# Altium schematic sheet UART Bus.SchDoc
size A
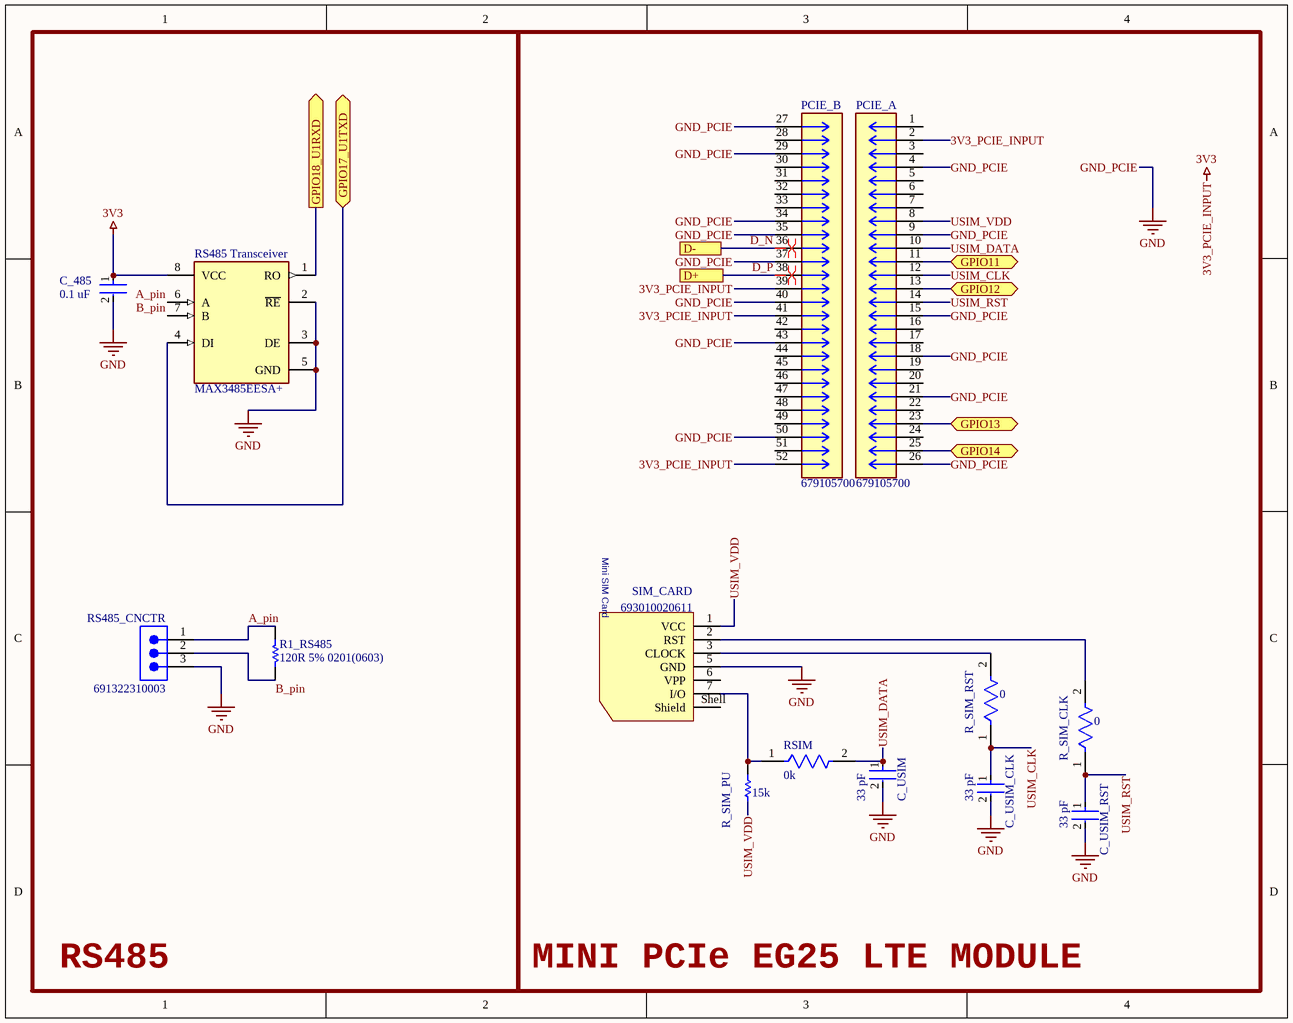
[diagram p0: UART Bus.SchDoc]

## Parts
C_485  0.1 uF  [FP-GRM155-0_05-MFG]
C_USIM  33 pF  [FP-GCM155-0_05-IPC_A]
C_USIM_CLK  33 pF  [FP-GCM155-0_05-IPC_A]
C_USIM_RST  33 pF  [FP-GCM155-0_05-IPC_A]
PCIE_  679105700  [CONN_679105700_MOL]  (parts A,B of 2)
R1_RS485  120R 5% 0201(0603)  [RESC0201(0603)_M]
R_SIM_CLK  0  [FP-CRG0402-IPC_C]
R_SIM_PU  15k  [RESC3116X65X40NL10T20]
R_SIM_RST  0  [FP-CRG0402-IPC_C]
RS485_CNCTR  691322310003  [691322310003]
RS485_Transceiver  MAX3485EESA+  [FP-S8-5-MFG]
RSIM  0k  [FP-CRG0402-IPC_C]
SIM_CARD  693010020611  [693010020611]

## Blocks framed on the sheet
RS485: C_485 R1_RS485 RS485_CNCTR RS485_Transceiver
MINI PCIe EG25 LTE MODULE: C_USIM C_USIM_CLK C_USIM_RST PCIE_ R_SIM_CLK R_SIM_PU R_SIM_RST RSIM SIM_CARD

## Ports
D+, D-, GPIO11 (bidir), GPIO12 (bidir), GPIO13 (bidir), GPIO14 (bidir), GPIO17_U1TXD (bidir), GPIO18_U1RXD (out)

## Nets
3V3_PCIE_INPUT: C_485.1 PCIE_.2 PCIE_.39 PCIE_.41 PCIE_.52 RS485_Transceiver.8(VCC)  [also labelled 3V3]
GND_PCIE: C_485.2 C_USIM.2 C_USIM_CLK.2 C_USIM_RST.2 PCIE_.4 PCIE_.9 PCIE_.15 PCIE_.18 PCIE_.21 PCIE_.26 PCIE_.27 PCIE_.29 PCIE_.34 PCIE_.35 PCIE_.37 PCIE_.40 PCIE_.43 PCIE_.50 RS485_CNCTR.3 RS485_Transceiver.2(~{RE}) RS485_Transceiver.3(DE) RS485_Transceiver.5(GND) SIM_CARD.5(GND)  [also labelled GND]
A_pin: R1_RS485.1 RS485_CNCTR.1 RS485_Transceiver.6(A)
B_pin: R1_RS485.2 RS485_CNCTR.2 RS485_Transceiver.7(B)
D_N: PCIE_.36 ; port D-
D_P: PCIE_.38 ; port D+
GPIO11: PCIE_.11 ; port GPIO11
GPIO12: PCIE_.13 ; port GPIO12
GPIO13: PCIE_.23 ; port GPIO13
GPIO14: PCIE_.25 ; port GPIO14
GPIO17_U1TXD: RS485_Transceiver.4(DI) ; port GPIO17_U1TXD
GPIO18_U1RXD: RS485_Transceiver.1(RO) ; port GPIO18_U1RXD
USIM_CLK: C_USIM_CLK.1 PCIE_.12 R_SIM_RST.1
USIM_DATA: C_USIM.1 PCIE_.10 RSIM.2
USIM_RST: C_USIM_RST.1 PCIE_.14 R_SIM_CLK.1
USIM_VDD: PCIE_.8 R_SIM_PU.2 SIM_CARD.1(VCC)
NetR_SIM_CLK_2: R_SIM_CLK.2 SIM_CARD.2(RST)
NetR_SIM_PU_1: R_SIM_PU.1 RSIM.1 SIM_CARD.7(I/O)
NetR_SIM_RST_2: R_SIM_RST.2 SIM_CARD.3(CLOCK)

Not connected (* = marked no-connect by the designer): PCIE_ 1 3 5 6 7 16 17 19 20 22 24 28 30 31 32 33 42 44 45 46 47 48 49 51; SIM_CARD 6(VPP) Shell(Shield)

## Layout directives
differential pair: D_N, D_P

## Notes on the sheet
- (in symbol CMP-1502-00155-3) Mini SIM Card

## Library data of the parts
C_485 = CMP-06035-062118-1: Chip Multilayer Ceramic Capacitors for General Purpose, 0402, 0.10uF, X7R, 15%, 20%, 50V; RoHS Compliant: Yes
C_USIM C_USIM_CLK C_USIM_RST = CMP-2008-03705-2: Ceramic Capacitor for Automotive 33pF ±5% 50VDC C0G 0402 Paper T/R; Voltage Rating: 50V; Tolerance: 5%; Packaging: Tape and Reel; Case/Package: 0402; Package Quantity: 10000; Dielectric: C0G; Voltage Rating (DC): 50V; Case Code (Imperial): 0402; Width: 0.02inch; Length: 1mm; Capacitance: 33pF; Mount: Surface Mount; Case Code (Metric): 1005; Weight: 0.000212oz; Thickness: 0.022inch; Lead Free: Lead Free; Height: 0.5mm; Max Operating Temperature: 125°C; Termination: SMD/SMT; Min Operating Temperature: -55°C; Depth: 0.5mm; Ratings: AEC-Q200
PCIE_ = CMP-018-000000-1: Pin Count: 52; Package: None; Availability: Unavailable; MP: 679105700; Value: *; Source: 679105700.SchLib; Price: None; Design Item ID: 679105700; Component Type: Standard
R1_RS485 = CMP-1010-00052-1: 120R 0.05W 5% 0201 (0603 Metric)  SMD; Case-EIA: 0201; Case-Metric: 0603; Value: 120.00 Ohm; Power: 0.05 W; Tolerance: 5 %; Technology: SMT
R_SIM_CLK R_SIM_RST RSIM = CMP-03211-011400-1: RES SMD 0 OHM JUMPER 1/16W 0402; Number of Resistors: 1; Tolerance: 0%; Voltage Rating: 50V; Insulation Resistance: 1GR; Power Rating: 63mW; Temperature Coefficient: 200ppm/°C; Resistance: 0mR; Weight: 2.3E-05oz; Number of Terminations: 2; Technology: THICK FILM; Resistor Type: Thick Film; Mount: Surface Mount; Termination: Solder; Number of Pins: 2; RoHS Compliant: Yes; Packaging: Tape and Reel; Depth: 0.5mm; Case Code (Metric): 1005; Min Operating Temperature: -55°C; Series: CRG; Height: 0.35mm; Voltage Rating (DC): 50V; Case Code (Imperial): 0402; Max Operating Temperature: 125°C; ELV: Compliant; Case/Package: 0402; Length: 1mm; Radiation Hardening: No; Width: 0.5mm; Package Quantity: 10000
R_SIM_PU = CMP-2003-03512-1: Manufacturer: Yageo; Part Number: RC1206FR-1015KL
RS485_CNCTR = CMP-1502-01887-3: 322; 3.81mm Pitch Straight Pluggable Term Block; PCB Header; Through Hole; 3 Way; Voltage: 300V; Current: 10A; Gender: Male; Number of Contacts: 3; Number of Levels: 1; Lead Pitch: 3.81mm; Termination: Solder; Packaging: Box; Length: 10.5mm; Contact Plating: Tin; RoHS: Compliant; Number of Rows: 1; Contact Material: Tin; Height: 7.2mm; Color: Green; Number of Pins: 3; Max Operating Temperature: 105°C; Current Rating: 10A; Voltage Rating: 300V; Min Operating Temperature: -40°C; Pitch: 3.81mm; Mount: Through Hole; Number of Positions Per Level: 3; Width: 12.82mm
RS485_Transceiver = CMP-05679-000038-1: IC TXRX RS485/422 10MBPS 8SOIC; Manufacturer: Maxim Integrated; Number Of Receivers: 1; Simplex Duplex: Half Duplex; Data Rate: 15Mbits/s; Interface: RS-485,RS-422; Max Supply Voltage: 3.6V; Nominal Supply Current: 0.95-1.1mA; Min Supply Voltage: 3V; Standoff Height: 0.1mm; Mouser Description: RS-422/RS-485 Interface IC 3.3V 12Mbps Transceiver; Lead Free: Yes; Footprint Url: https://pdfserv.maximintegrated.com/land_patterns/90-0096.PDF; Device Class L1: Integrated Circuits (ICs); Device Class L3: RS-232 / RS-422 / RS-485 Interface ICs; RoHS: TRUE; Height: 1.75mm; ComponentLink2URL: https://datasheets.maximintegrated.com/en/ds/MAX3483E-MAX3491E.pdf; Temperature Range High: +85°C; Temperature: -40°C to +85°C; Manufacturer Part Number: MAX3485EESA+; Number Of Transmitters: 1; Device Class L2: Interface ICs; Octopart: https://octopart.com/max3485eesa%2B-maxim+integrated-39731903; ComponentLink2Description: Datasheet; Category: IC; Digikey Description: IC TXRX RS485/422 10MBPS 8SOIC; Automotive: No; Temperature Range Low: -40°C; Package: S8-5
SIM_CARD = CMP-1502-00155-3: WR-CRD Mini SIM Card Connector Header Shielded; Current Rating: 500mA; Operating Supply Voltage: 50V; Insulation Resistance: 500MΩ; Connector Type: Connector, Socket; Number of Positions: 6; Mount: Surface Mount; Max Operating Temperature: 85°C; Length: 16.4mm; Height: 1.8mm; REACH SVHC: Unknown; Number of Contacts: 6; Min Operating Temperature: -25°C; Number of Pins: 6; Contact Material: Copper; Width: 16.3mm; Contact Plating: Gold; Packaging: Tape and Reel; RoHS: Compliant